# Altium schematic sheet MCU Schematic.SchDoc
size D; SheetNumber: 1; SheetTotal: 1
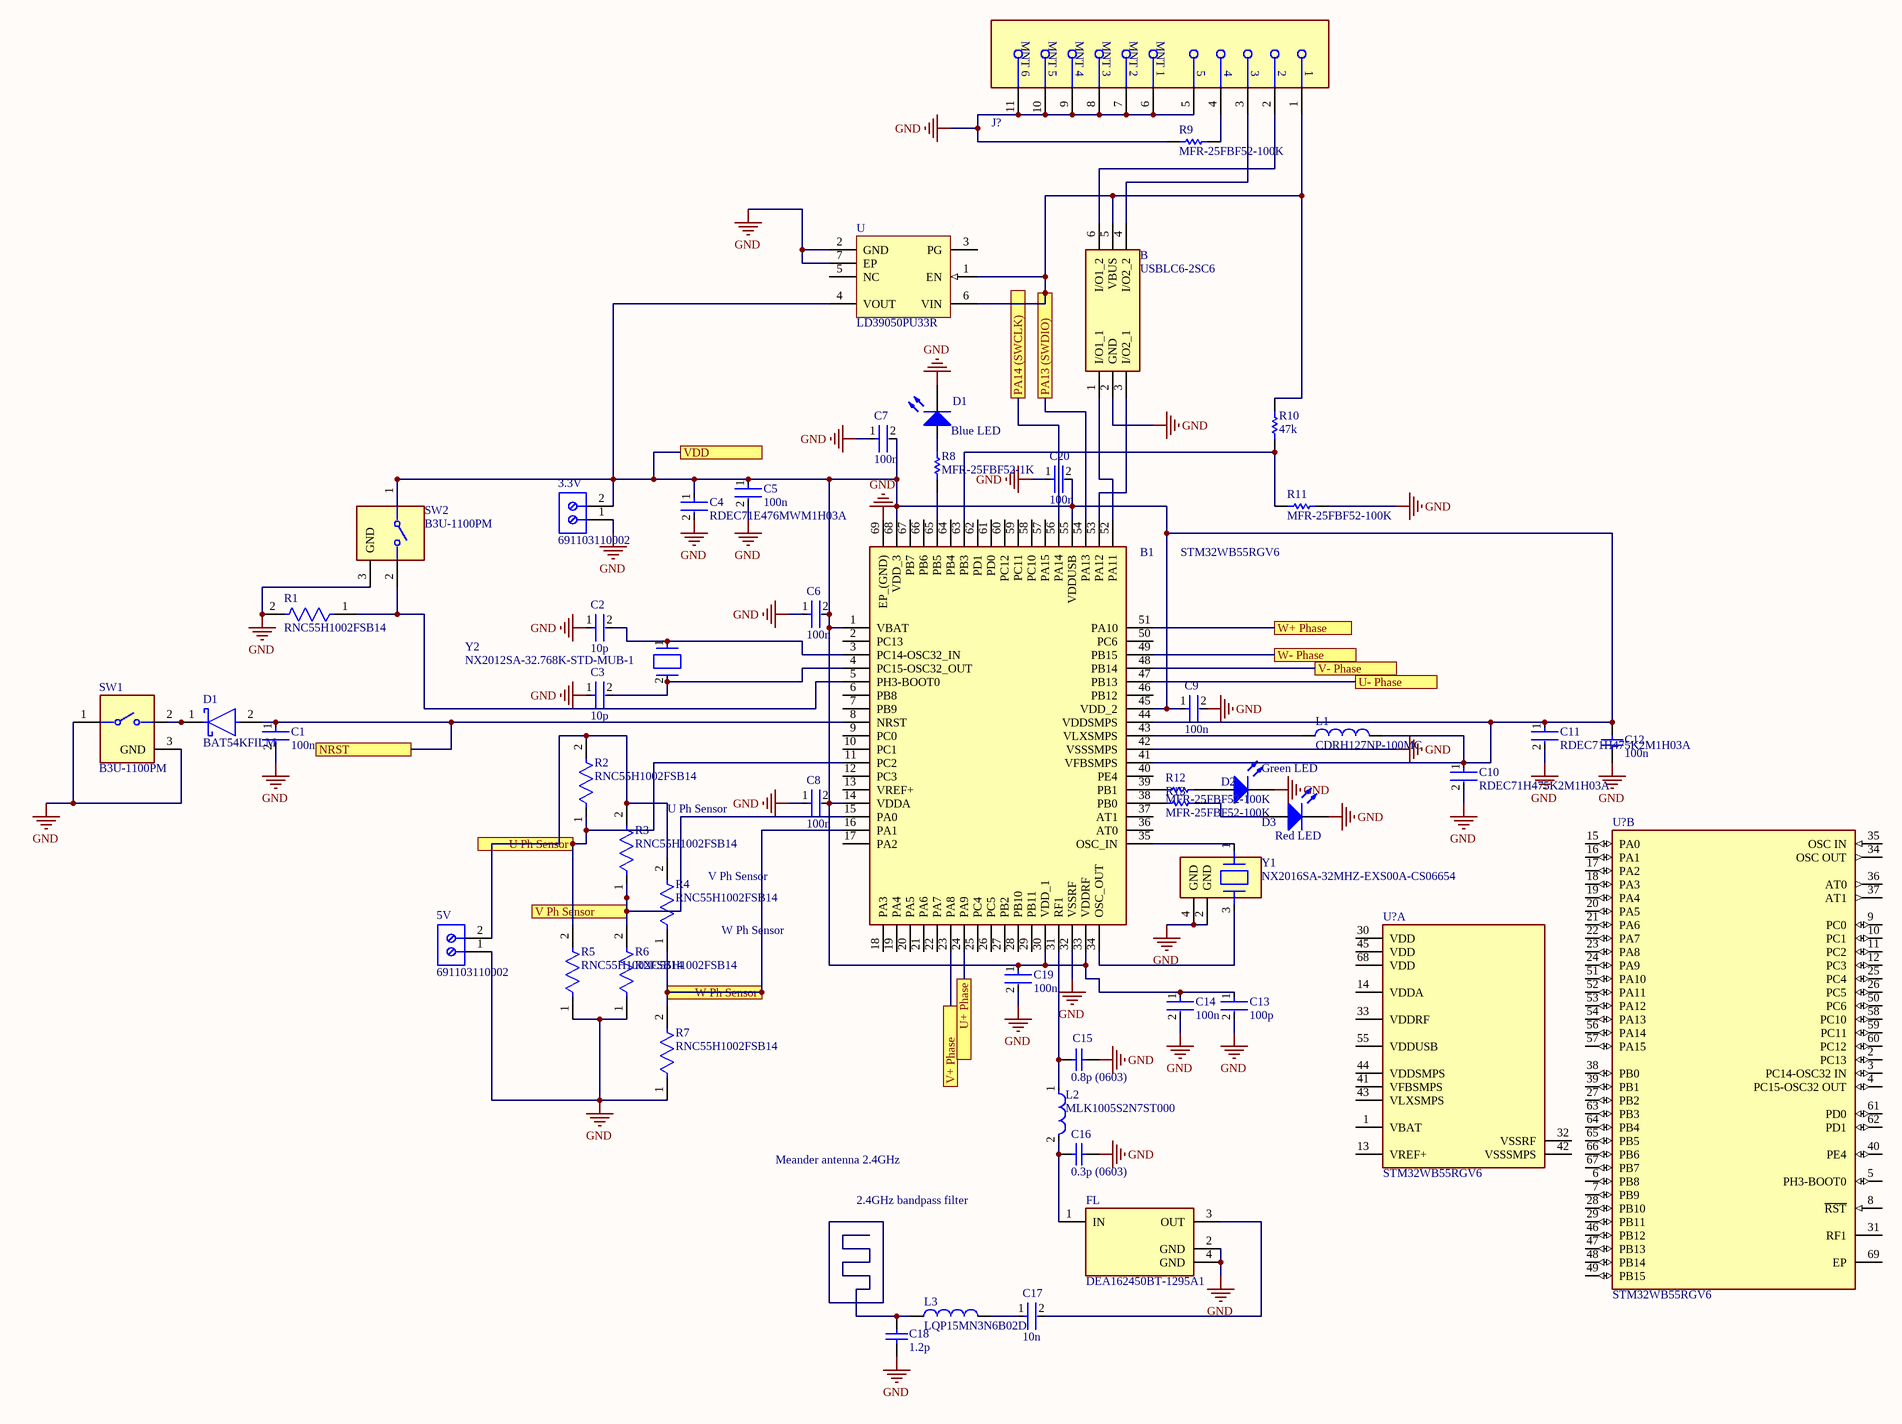
[diagram p0: MCU Schematic.SchDoc]

## Parts
(Parts that share a designator on the sheet are numbered #1, #2 ... from top to bottom, then left to right.)
3.3V  691103110002  [691103110002]
5V  691103110002  [691103110002]
B  USBLC6-2SC6  [SOT95P280X145-6N]
B1  STM32WB55RGV6  [QFN40P800X800X100-69N-D]
C1  100n  [FP-RDE2M1-MFG]
C2  10p  [FP-RDE2M1-MFG]
C3  10p  [FP-RDE2M1-MFG]
C4  RDEC71E476MWM1H03A  [FP-RDEWK1-MFG]
C5  100n  [FP-RDE2M1-MFG]
C6  100n  [FP-RDE2M1-MFG]
C7  100n  [FP-RDE2M1-MFG]
C8  100n  [FP-RDE2M1-MFG]
C9  100n  [FP-RDE2M1-MFG]
C10  RDEC71H475K2M1H03A  [FP-RDE2M1-MFG]
C11  RDEC71H475K2M1H03A  [FP-RDE2M1-MFG]
C12  value 100n  (hidden comment: Capacitor)
C13  100p  [FP-RDE2M1-MFG]
C14  100n  [FP-RDE2M1-MFG]
C15  0.8p (0603)  [CAPC1608X92X38NL15T08]
C16  0.3p (0603)  [CAPC1608X92X38NL15T08]
C17  10n  [FP-RDE2M1-MFG]
C18  value 1.2p  (hidden comment: Capacitor)
C19  100n  [FP-RDE2M1-MFG]
C20  100n  [FP-RDE2M1-MFG]
D1#1  Light-Emitting Diode  (value not drawn)
D1#2  BAT54KFILM  [FP-SOD-523-MFG]
D2  Light-Emitting Diode  (value not drawn)
D3  Light-Emitting Diode  (value not drawn)
FL  DEA162450BT-1295A1  [FP-DEA162450BT-1295A1-MFG]
J?  1050170001  (value not drawn)
L1  CDRH127NP-100MC  [SUMI-CDRH127_V]
L2  MLK1005S2N7ST000  [FP-MLK1005-IPC_C]
L3  LQP15MN3N6B02D  [MURA-LQP15MN3N6B02D-2_N]
R1  RNC55H1002FSB14  [FP-RNC55-MFG]
R2  RNC55H1002FSB14  [FP-RNC55-MFG]
R3  RNC55H1002FSB14  [FP-RNC55-MFG]
R4  RNC55H1002FSB14  [FP-RNC55-MFG]
R5  RNC55H1002FSB14  [FP-RNC55-MFG]
R6  RNC55H1002FSB14  [FP-RNC55-MFG]
R7  RNC55H1002FSB14  [FP-RNC55-MFG]
R8  MFR-25FBF52-1K  [RESA60-630X240]
R9  MFR-25FBF52-100K  [RESA60-630X240]
R10  47k  [RESA60-630X240]
R11  MFR-25FBF52-100K  [RESA60-630X240]
R12  MFR-25FBF52-100K  [RESA60-630X240]
R13  MFR-25FBF52-100K  [RESA60-630X240]
SW1  B3U-1100PM  [FP-B3U-1100PM-MFG]
SW2  B3U-1100PM  [FP-B3U-1100PM-MFG]
U  LD39050PU33R  [DFN6D_L]
U?#1  STM32WB55RGV6  [FP-VFQFPN-68-B029-MFG]  (part B of 2)
U?#2  STM32WB55RGV6  [FP-VFQFPN-68-B029-MFG]  (part A of 2)
Y1  NX2016SA-32MHZ-EXS00A-CS06654  [FP-NX2016SA-MFG]
Y2  NX2012SA-32.768K-STD-MUB-1  [FP-NX2012SA-MFG]

## Ports
NRST, PA13 (SWDIO), PA14 (SWCLK), U Ph Sensor, U+ Phase, U- Phase, V Ph Sensor, V+ Phase, V- Phase, VDD, W Ph Sensor, W+ Phase, W- Phase

## Nets
GND: 3.3V.1 5V.1 B.2(GND) B1.32(VSSRF) B1.42(VSSSMPS) B1.69(EP_(GND)) C1.2 C2.1 C3.1 C4.2 C5.2 C6.1 C7.1 C8.1 C9.2 C10.2 C11.2 C12.1 C13.2 C14.2 C15.2 C16.2 C18.1 C19.2 C20.1 D1#1.2(K) D2.2(K) D3.2(K) FL.2(GND) FL.4(GND) J?.5 J?.6(MNT_1) J?.7(MNT_2) J?.8(MNT_3) J?.9(MNT_4) J?.10(MNT_5) J?.11(MNT_6) R1.2 R5.1 R6.1 R7.1 R9.1 R11.2 SW1.1 SW1.3(GND) SW2.3(GND) U.2(GND) U.7(EP) Y1.2(GND) Y1.4(GND)
NRST: B1.8(NRST) C1.1 D1#2.2(A) ; port NRST
PA13 (SWDIO): B.5(VBUS) B1.54(PA13) J?.1 R10.2 U.1(EN) U.6(VIN) ; port PA13 (SWDIO)
PA14 (SWCLK): B1.56(PA14) ; port PA14 (SWCLK)
U Ph Sensor: B1.11(PC2) R2.1 R5.2 ; port U Ph Sensor
U+ Phase: B1.24(PA9) ; port U+ Phase
U- Phase: B1.47(PB13) ; port U- Phase
V Ph Sensor: B1.15(PA0) R3.1 R6.2 ; port V Ph Sensor
V+ Phase: B1.23(PA8) ; port V+ Phase
V- Phase: B1.48(PB14) ; port V- Phase
VDD: 3.3V.2 B1.1(VBAT) B1.14(VDDA) B1.30(VDD_1) B1.33(VDDRF) B1.41(VFBSMPS) B1.44(VDDSMPS) B1.45(VDD_2) B1.55(VDDUSB) B1.68(VDD_3) C4.1 C5.1 C6.2 C7.2 C8.2 C9.1 C10.1 C11.1 C12.2 C13.1 C14.1 C19.1 C20.2 L1.2 SW2.1 U.4(VOUT) ; port VDD
W Ph Sensor: B1.16(PA1) R4.1 R7.2 ; port W Ph Sensor
W+ Phase: B1.51(PA10) ; port W+ Phase
W- Phase: B1.49(PB15) ; port W- Phase
Net5V_2: 5V.2 R2.2 R3.2 R4.2
NetB1_3: B1.3(PC14-OSC32_IN) C2.2 Y2.1
NetB1_4: B1.4(PC15-OSC32_OUT) C3.2 Y2.2
NetB1_5: B1.5(PH3-BOOT0) R1.1 SW2.2
NetB1_31: B1.31(RF1) C15.1 L2.1
NetB1_34: B1.34(OSC_OUT) Y1.3
NetB1_35: B1.35(OSC_IN) Y1.1
NetB1_38: B1.38(PB0) R13.1
NetB1_39: B1.39(PB1) R12.1
NetB1_43: B1.43(VLXSMPS) L1.1
NetB1_63: B1.63(PB3) R10.1 R11.1
NetB1_65: B1.65(PB5) R8.1
NetB_1: B.1(I/O1_1) B1.52(PA11)
NetB_3: B.3(I/O2_1) B1.53(PA12)
NetB_4: B.4(I/O2_2) J?.3
NetB_6: B.6(I/O1_2) J?.2
NetC16_1: C16.1 FL.1(IN) L2.2
NetC17_1: C17.1 L3.2
NetC17_2: C17.2 FL.3(OUT)
NetC18_2: C18.2 L3.1
NetD1#1_1: D1#1.1(A) R8.2
NetD1#2_1: D1#2.1(C) SW1.2
NetD2_1: D2.1(A) R12.2
NetD3_1: D3.1(A) R13.2
NetJ?_4: J?.4 R9.2

Not connected (* = marked no-connect by the designer): B1 2(PC13) 6(PB8) 7(PB9) 9(PC0) 10(PC1) 12(PC3) 13(VREF+) 17(PA2) 18(PA3) 19(PA4) 20(PA5) 21(PA6) 22(PA7) 25(PC4) 26(PC5) 27(PB2) 28(PB10) 29(PB11) 36(AT0) 37(AT1) 40(PE4) 46(PB12) 50(PC6) 57(PA15) 58(PC10) 59(PC11) 60(PC12) 61(PD0) 62(PD1) 64(PB4) 66(PB6) 67(PB7); U 3(PG) 5(NC); U?#1 2(PC13) 3(PC14-OSC32_IN) 4(PC15-OSC32_OUT) 5(PH3-BOOT0) 6(PB8) 7(PB9) 8(~{RST}) 9(PC0) 10(PC1) 11(PC2) 12(PC3) 15(PA0) 16(PA1) 17(PA2) 18(PA3) 19(PA4) 20(PA5) 21(PA6) 22(PA7) 23(PA8) 24(PA9) 25(PC4) 26(PC5) 27(PB2) 28(PB10) 29(PB11) 31(RF1) 34(OSC_OUT) 35(OSC_IN) 36(AT0) 37(AT1) 38(PB0) 39(PB1) 40(PE4) 46(PB12) 47(PB13) 48(PB14) 49(PB15) 50(PC6) 51(PA10) 52(PA11) 53(PA12) 54(PA13) 56(PA14) 57(PA15) 58(PC10) 59(PC11) 60(PC12) 61(PD0) 62(PD1) 63(PB3) 64(PB4) 65(PB5) 66(PB6) 67(PB7) 69(EP); U?#2 1(VBAT) 13(VREF+) 14(VDDA) 30(VDD) 32(VSSRF) 33(VDDRF) 41(VFBSMPS) 42(VSSSMPS) 43(VLXSMPS) 44(VDDSMPS) 45(VDD) 55(VDDUSB) 68(VDD)

## Notes on the sheet
- Blue LED
- Green LED
- U Ph Sensor
- (near D3) Red LED
- (near R4) V Ph Sensor
- W Ph Sensor
- Meander antenna 2.4GHz
- 2.4GHz bandpass filter

## Library data of the parts
3.3V 5V = CMP-1502-03254-2: NexarPartId: 18818286; Pitch: 3.5052mm; Current Rating: 10A; Number of Positions Per Level: 2; Plating: Steel; Number of Levels: 1; Voltage: 125V; Wire/Cable Gauge: 26AWG; Stripping Length: -6mm; Wire Gauge (Min): 16AWG; Packaging: Box; Number of Rows: 1; Color: Blue; Height: 8.5mm; Current: 10A; Lead Pitch: 3.5mm; RoHS: Compliant; Housing Material: Nylon; Width: 8mm; Length: 7mm; Contact Plating: Tin; Number of Pins: 2; Mount: Through Hole; Min Operating Temperature: -40°C; Number of Contacts: 2; REACH SVHC: Unknown; Termination: Screw; Wire Gauge (Max): 26AWG; Max Operating Temperature: 105°C; Voltage Rating: 125V; Contact Material: Brass, Copper, Nickel, Tin, Zinc
B = USBLC6-2SC6: TVS Diode Array Uni-Directional USBLC6-2SC6 17V, SOT-23 6-Pin; Manufacturer_Name: STMicroelectronics; Geometry.Height: 1.45mm; Manufacturer_Part_Number: USBLC6-2SC6; Mouser Part Number: 511-USBLC6-2SC6; Mouser Price/Stock: https://www.mouser.co.uk/ProductDetail/STMicroelectronics/USBLC6-2SC6?qs=po45yt2pPpu%2FhNIlwQdTlg%3D%3D; Arrow Part Number: USBLC6-2SC6; Arrow Price/Stock: https://www.arrow.com/en/products/usblc6-2sc6/stmicroelectronics?utm_currency=USD&region=europe; Datasheet Link: https://www.st.com/resource/en/datasheet/usblc6-2.pdf
B1 = STM32WB55RGV6: ARM Microcontrollers - MCU Ultra-low-power dual core Arm Cortex-M4 MCU 64 MHz, Cortex-M0 32MHz with 1 Mbyte Flash, BLE, 802.15.4, USB, LCD, AES-256; Manufacturer_Name: STMicroelectronics; Geometry.Height: 1mm; Manufacturer_Part_Number: STM32WB55RGV6; Mouser Part Number: 511-STM32WB55RGV6; Mouser Price/Stock: https://www.mouser.co.uk/ProductDetail/STMicroelectronics/STM32WB55RGV6?qs=lYGu3FyN48cg9Kq%252BQIugSQ%3D%3D; Arrow Part Number: STM32WB55RGV6; Arrow Price/Stock: https://www.arrow.com/en/products/stm32wb55rgv6/stmicroelectronics?utm_currency=USD&region=nac; Datasheet Link: https://www.st.com/resource/en/datasheet/stm32wb55cc.pdf
C1-C3 C5-C11 C13 C14 C17 C19 C20 = CMP-06035-049833-1: Ceramic Capacitor 4.7uF ±10% 50V X7S Radial; Lead Diameter: 0.5mm; Lead/Base Style: Kinked; Lead Pitch: 0.197inch; Height - Seated (Max): 0.236inch; Dielectric: X7S; Case/Package: Radial; Voltage Rating: 50V; Min Operating Temperature: -55°C; Voltage Rating (DC): 50V; Max Operating Temperature: 125°C; Length: 0.217inch; Capacitance: 4.7uF; Tolerance: 10%; Package Quantity: 1500; Packaging: Tape and Reel; Width: 0.124inch; Termination: Radial; Resistor Type: Ceramic; Mount: Through Hole; Height: 4mm
C4 = CMP-06035-054222-1: Ceramic Capacitor 47uF ±20% 25V X7S Radial; Lead/Base Style: Kinked; Lead Diameter: 0.5mm; Height - Seated (Max): 0.394inch; Max Operating Temperature: 125°C; Mount: Through Hole; Height: 7.5mm; Voltage Rating: 25V; Lead Pitch: 0.197inch; Package Quantity: 1500; Min Operating Temperature: -55°C; Case/Package: Radial; Dielectric: X7S; Termination: Radial; Resistor Type: Ceramic; Length: 0.217inch; Packaging: Tape and Reel; Voltage Rating (DC): 25V; Tolerance: 20%; Width: 7.5mm; Capacitance: 47uF
C12 C18 = Capacitor: SimulationGenericComponent: True
C15 C16 = CMP-2006-01132-1: Manufacturer: Vitramon; Part Number: VJ0603Y473KXAAC
D1#1 D2 D3 = LED: AF: 1; BV: 0; BV_MAX: 1e99; EG: 1.11; FC: 0.5; IBV: 0.001; IS: 1e-14; MJSW: 0.33; NTUN: 30; TNOM: 27; XTI: 3; SimulationGenericComponent: True; CJO: 0; CJP: 0; CTA: 0; CTP: 0; FCS: 0.5; FV_MAX: 1e99; IKF: 0; IKR: 0; ISR: 1e-14; JSW: 0; JTUN: 0; JTUNSW: 0; KEG: 1; KF: 0; LEVEL: 1; N: 1; NBV: 1; NR: 1; NS: 1; PHP: 1; RS: 0; TCV: 0; TLEV: 0; TLEVC: 0; TM1: 0; TM2: 0; TPB: 0; TPHP: 0; TRS: 0; TRS2: 0; TT: 0; TTT1: 0; TTT2: 0; VJ: 1; XTITUN: 3
D1#2 = CMP-12187-000026-1: DIODE SCHOTTKY 40V 300MA SOD523; Manufacturer: STMicroelectronics; Capacitance: 7pF; Value: 7pF; Max Surge Forward Current: 1.25A; Peak Reverse Current: 1uA; Max Junction Temp: +150°C; Device Class L2: Diodes; Temperature Range Low: -40°C; Category: Diode; Manufacturer Part Number: BAT54KFILM; Digikey Description: DIODE SCHOTTKY 40V 300MA SOD523; Device Class L3: Schottky Diodes; Automotive: No; Height: 0.7mm; Octopart: https://octopart.com/bat54kfilm-stmicroelectronics-39618022; ComponentLink2Description: Datasheet; Temperature Range High: +150°C; Device Class L1: Discrete Semiconductors; Max Repetitive Reverse Voltage: 40V; RoHS: TRUE; Temperature: -40°C to +150°C; ComponentLink2URL: https://www.st.com/content/ccc/resource/technical/document/datasheet/07/50/54/f2/0d/ba/4a/79/CD00001322.pdf/files/CD00001322.pdf/jcr:content/translations/en.CD00001322.pdf; Lead Free: Yes; Forward Current: 300mA; Package: SOD-523; Mouser Description: Schottky Diodes & Rectifiers schottky diode
FL = CMP-08258-000001-1: RF FILTER BAND PASS 2.45GHZ 0603; Bandwidth: 100MHz; Insertion Loss: 1.8dB; Case Code (Imperial): 0603; Frequency: 2.45GHz; RoHS Compliant: Yes; Case Code (Metric): 1608; Packaging: Tape and Reel; Mount: Surface Mount
L1 = CMP-2000-06084-1: Power Inductor, 10 uH, +/- 20%, -40 to 100 degC, 2-Pin SMD, RoHS, Tape and Reel; Manufacturer: Sumida; Catalog Drawings: CDRH127SeriesFrontCDRH127SeriesSideCDRH127SeriesBottom; Product Training Modules: PowerInductorBasics; Current Rating: 5.4A; Shielding: Shielded; Online Catalog: CDRHSeries; DC Resistance (DCR): 21.6mOhmMax; Other Names: 308-1457-1; Inductance: 10µH; Frequency - Test: 1kHz; Mounting Type: SurfaceMount; Datasheet Version: 01/2014; Package Description: 2-Pin Surface Mount Device, Body 12 x 12 mm; Frequency - Self Resonant: -; Package Reference: CDRH127; Category: Inductors,Coils,Chokes; Material - Core: -; Q @ Freq: -; Type: -; Family: FixedInductors; Ratings: -; Series: CDRH127; Manufacturer URL: http://www.sumida.com/; Operating Temperature: -40°C~100°C; Height - Seated (Max): 0.315"(8.00mm); Standard Package: 1; Size / Dimension: 0.472"Lx0.472"W(12.00mmx12.00mm); Current - Saturation: -; Datasheet URL: http://products.sumida.com/products/pdf/CDRH127.pdf; Package / Case: Nonstandard; Tolerance: ±20%; Mounting Technology: SurfaceMount; Packaging: CutTape(CT)
L2 = CMP-08253-000188-1: Unshielded Multilayer Inductor 2.7nH ±0.3nH 500mA 0.2Ω SMD 0402; Core Material: Ceramic; Self Resonant Frequency: 7.5GHz; DC Resistance (DCR): 200mR; Test Frequency: 100MHz; Width: 0.02inch; Height - Seated (Max): 0.024inch; Case/Package: 0402; Packaging: Tape and Reel; Max Operating Temperature: 125°C; Case Code (Metric): 1005; Current Rating: 500mA; Height: 0.6mm; Max DC Current: 500mA; Series: MLK; Radiation Hardening: No; Inductance: 2.7nH; Min Operating Temperature: -55°C; Shielding: Unshielded; Case Code (Imperial): 0402; Package Quantity: 1; Depth: 0.6mm; Mount: Surface Mount; Length: 0.039inch; RoHS Compliant: Yes
L3 = CMP-1662-00027-1: Inductor, 500 MHz, 170 mA, 0.5 Ohm, -40 to 85 degC, 01005 (0402 Metric), RoHS, Tape and Reel; Viewing Angle: 130 degrees; Case\Package: 0603; Power Rating: 70 mW; Luminous Intensity: 28 mcd; Forward Current: 5 mA; Nominal Vf: 2.93 V; Lens Style: Diffused; Forward Voltage: 3.15 V; Colour: White; Min Operating Temperature: -20 degC; RoHSCompliant: true; PackageDescription: 2-Pin Surface Mount Device, Body 1 x 0.5 mm; Package Quantity: 1; Max Operating Temperature: 80 degC; Radiation Hardening: No; Pins: 2; ComponentLink1URL: http://www.murata.com/; Case Code (Metric): 1608; ComponentLink1Description: Manufacturer URL; Case Code (Imperial): 0603; ComponentLink2URL: http://download.siliconexpert.com/pdfs/2016/4/21/8/25/31/646/mrt_/manual/797549851250188lqp15mn3n6b0223.pdf; PackageReference: 0402; Height: 0.55 mm; Packaging: Tape and Reel; Width: 0.8 mm; DatasheetVersion: Apr-16; Length: 1.6 mm; Mount: Surface Mount; Illumination Colour: White; ComponentLink2Description: Datasheet
R1-R7 = CMP-02408-000004-1: RES 10K OHM 1/8W 1% AXIAL; Manufacturer: Vishay; Voltage Rating: 200V; Power Rating: 0.125W; Resistance: 10kΩ; Temperature Coefficient: 50ppm/°C; Value: 10kΩ; Automotive: No; Category: Res; Tolerance: 1%; Temperature: -65°C to +175°C; Device Class L2: Resistors; Composition: Metal Film; Height: 2.69mm; Failure Rate: 0.001%; ComponentLink2URL: https://www.vishay.com/docs/31025/erc.pdf; Manufacturer Part Number: RNC55H1002FSB14; Temperature Range High: +175°C; Lead Free: No; Series: RNC; Device Class L1: Passive Components; Ipc Land Pattern Name: RESAD1100W85L762D269; Octopart: https://octopart.com/rnc55h1002fs-vishay-40848808; Package: RNC55; RoHS: FALSE; Military Standard: true; Device Class L3: Through-Hole Resistors; ComponentLink2Description: Datasheet; Digikey Description: RES 10K OHM 1/8W 1% AXIAL; Temperature Range Low: -65°C
R8 = CMP-1659-00075-1: Axial Resistor, 1 KOhm, +/- 1%, 250 mW, -55 to 155 degC, 2-Pin THD, RoHS, Bulk; Voltage Rating: 250 V; Resistance: 10 kohm; Power Rating: 250 mW; ComponentLink2Description: Datasheet; RoHSCompliant: true; PackageReference: MFR-25; Case\Package: Axial; Max Operating Temperature: 155 degC; DatasheetVersion: Apr-13; Tolerance: 1%; ComponentLink1URL: http://www.yageo.com/; Length: 0.248 inch; ComponentLink2URL: http://www.yageo.com/documents/recent/Yageo%20LR_MFR_2013.pdf; Packaging: Bulk; Package Quantity: 200; PackageDescription: 2-Pin Axial Lead, Dia 2.4 mm, Body Length 6.3 mm; Min Operating Temperature: -55 degC; ComponentLink1Description: Manufacturer URL
R9-R13 = CMP-1659-00073-1: Axial Resistor, 100 KOhm, +/- 1%, 0.25 W, -55 to 155 degC, 2-Pin THD, RoHS, Bulk; Voltage Rating: 250 V; Power Rating: 250 mW; Resistance: 475 Ohm; PackageDescription: 2-Pin Axial Lead, Dia 2.4 mm, Body Length 6.3 mm; PackageReference: MFR-25; Length: 0.248 inch; ComponentLink2Description: Datasheet; Packaging: Bulk; DatasheetVersion: Apr-13; Package Quantity: 200; Min Operating Temperature: -55 degC; ComponentLink2URL: http://www.yageo.com/documents/recent/Yageo%20LR_MFR_2013.pdf; RoHSCompliant: true; ComponentLink1URL: http://www.yageo.com/; Tolerance: 1%; Case\Package: Axial; Mount: Through Hole; ComponentLink1Description: Manufacturer URL; Max Operating Temperature: 155 degC
SW1 SW2 = CMP-08834-000028-1: SWITCH TACTILE SPST-NO 0.05A 12V; Switch Travel: 0.15mm; Throw Configuration: SPST; Current Rating: 50mA; Illumination Type: Non-Illuminated; Actuator Length: 0.4mm; Operating Force: 1.5N; Connector Type: SMD/SMT; Contact Resistance: 100mR; Actuator Type: Standard; Electrical Life: 200000Cycles; Switch Function: Off-Mom; Ratings: Dust Proof; Max Operating Temperature: 70°C; Weight: 0.022g; Series: B3U; Min Operating Temperature: -25°C; Voltage Rating (DC): 12V; Orientation: Straight; Package Quantity: 1000; Packaging: Tape and Reel; RoHS Compliant: Yes; REACH SVHC: No SVHC; Max Voltage Rating (DC): 12V; Mount: Surface Mount; Case/Package: SMD/SMT; Mechanical Life: 200000Cycles; Termination: SMD/SMT
U = CMP-0244-00288-1: 500 mA Low Quiescent Current Low Noise Voltage Regulator, 3.3V, 6-Pin VDFDPN, Tape and Reel; PackageReference: DFN6D; ComponentLink1Description: Manufacturer URL; ComponentLink1URL: http://www.st.com; PackageVersion: 2008; PackageDescription: 6-Pin Plastic, Dual LLP, 3 x 3 mm Body, 0.95 mm Pitch, Exposed Pad; ComponentLink2URL: http://www.st.com/internet/com/TECHNICAL_RESOURCES/TECHNICAL_LITERATURE/DATASHEET/CD00227527.pdf; DatasheetVersion: 1/03/2009; ComponentLink2Description: Datasheet
U?#1 U?#2 = CMP-12160-000001-1: ULTRA-LOW-POWER DUAL CORE ARM CO; Manufacturer: STMicroelectronics; Max Junction Temp: +125°C; Bandwidth: 75MHz; Max Frequency: 2480MHz; Sensitivity: -96dBm; Number Of Adc Channels: 19; Receiving Current: 4.5-7.9mA; Interface: I2C,SPI,UART,USART,USB; Data Rate: 2Mbits/s; Number Of Gpio: 49; Min Supply Voltage: 1.71V; Max Power Dissipation: 425mW; Max Supply Voltage: 3.6V; Standoff Height: 0mm; Octopart: https://octopart.com/stm32wb55rgv6-stmicroelectronics-98750848; Category: IC; Digikey Description: ULTRA-LOW-POWER DUAL CORE ARM CO; Height: 1mm; Device Class L2: RF Semiconductors and Devices; Automotive: No; Ambient Temperature Range High: +105°C; ComponentLink2Description: Datasheet; Ambient Temperature Range Low: -40°C; Lead Free: Yes; Temperature Range Low: -40°C; Ipc Land Pattern Name: QFN40P800X800X90-68; Device Class L1: Integrated Circuits (ICs); Manufacturer Part Number: STM32WB55RGV6; Package: VFQFPN-68-B029; RoHS: TRUE; Temperature Range High: +125°C; ComponentLink2URL: https://www.st.com/resource/en/datasheet/stm32wb55rg.pdf; Temperature: -40°C to +125°C; Device Class L3: Transceivers; Mouser Description: MCU 32-Bit STM32WB55 ARM Cortex M4 RISC 1MB Flash 1.7V to 3.6V 68-Pin VFQFPN Tray
Y1 = CMP-200220-000017-1: CRYSTAL 32.0000MHZ 8PF SMD; Frequency: 32MHz; ESR (Equivalent Series Resistance): 60R; Ratings: AEC-Q200; Mount: Surface Mount; Case/Package: SMD/SMT; Packaging: Tape and Reel; Load Capacitance: 8pF; Min Operating Temperature: -40°C; Max Operating Temperature: 125°C
Y2 = CMP-200220-000019-1: CRYSTAL 32.7680KHZ 12.5PF SMD; Frequency Tolerance: 20ppm; ESR (Equivalent Series Resistance): 80kR; Frequency: 32.768kHz; Mount: Surface Mount; Packaging: Cut Tape; Min Operating Temperature: -40°C; Max Operating Temperature: 85°C; Case/Package: SMD/SMT; RoHS Compliant: Yes; Length: 0.081inch; Series: NX2012SA; Height: 0.024inch; Width: 0.047inch; Load Capacitance: 12.5pF